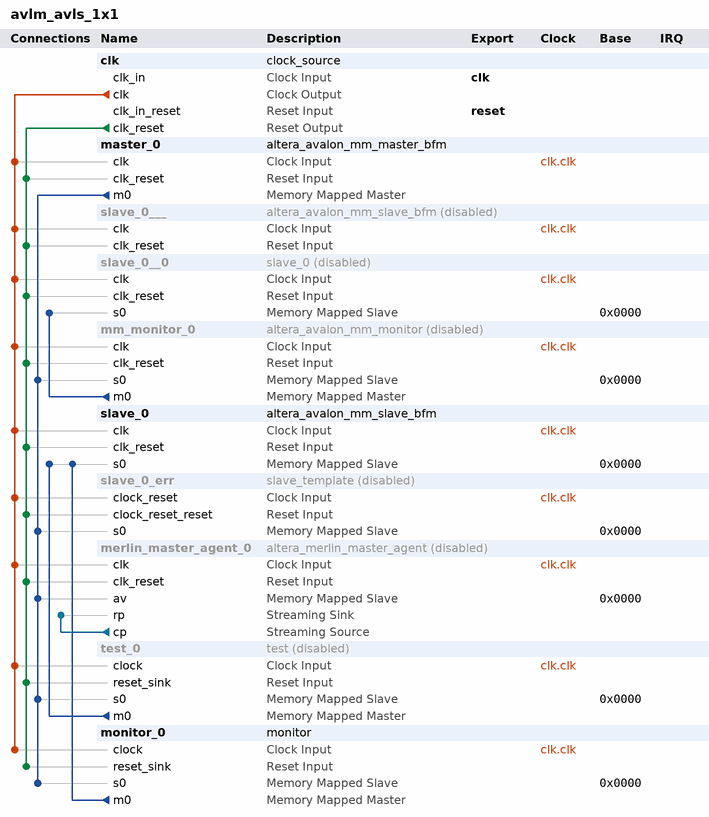
[diagram p0: system contents]
# Platform Designer (Qsys) system avlm_avls_1x1, Cyclone V 5CSEBA6U23I7
# Parameters at their usual value, and those the tool derives, are not listed.
package require -exact qsys 21.1
create_system avlm_avls_1x1
set_project_property DEVICE_FAMILY {Cyclone V}
set_project_property DEVICE 5CSEBA6U23I7

add_instance clk clock_source 21.1
set_instance_parameter_value clk clockFrequency 50000000
set_instance_parameter_value clk resetSynchronousEdges DEASSERT

add_instance master_0 altera_avalon_mm_master_bfm 21.1
set_instance_parameter_value master_0 ADDRESS_UNITS SYMBOLS
set_instance_parameter_value master_0 AV_ADDRESS_W 32
set_instance_parameter_value master_0 AV_ALWAYS_BURST_MAX_BURST 0
set_instance_parameter_value master_0 AV_BURSTCOUNT_W 4
set_instance_parameter_value master_0 AV_BURST_BNDR_ONLY 0
set_instance_parameter_value master_0 AV_BURST_LINEWRAP 0
set_instance_parameter_value master_0 AV_CONSTANT_BURST_BEHAVIOR 1
set_instance_parameter_value master_0 AV_FIX_READ_LATENCY 0
set_instance_parameter_value master_0 AV_MAX_PENDING_READS 8
set_instance_parameter_value master_0 AV_MAX_PENDING_WRITES 0
set_instance_parameter_value master_0 AV_NUMSYMBOLS 4
set_instance_parameter_value master_0 AV_READRESPONSE_W 8
set_instance_parameter_value master_0 AV_READ_WAIT_TIME 1
set_instance_parameter_value master_0 AV_WRITERESPONSE_W 8
set_instance_parameter_value master_0 USE_BURSTCOUNT 1
set_instance_parameter_value master_0 USE_BYTE_ENABLE 1
set_instance_parameter_value master_0 USE_READ 1
set_instance_parameter_value master_0 USE_READ_DATA 1
set_instance_parameter_value master_0 USE_READ_DATA_VALID 1
set_instance_parameter_value master_0 USE_WAIT_REQUEST 1
set_instance_parameter_value master_0 VHDL_ID 0

add_instance slave_0___ altera_avalon_mm_slave_bfm 21.1
set_instance_property slave_0___ ENABLED false
set_instance_parameter_value slave_0___ ADDRESS_UNITS SYMBOLS
set_instance_parameter_value slave_0___ ASSERT_HIGH_ARBITERLOCK 1
set_instance_parameter_value slave_0___ ASSERT_HIGH_BYTEENABLE 1
set_instance_parameter_value slave_0___ ASSERT_HIGH_LOCK 1
set_instance_parameter_value slave_0___ ASSERT_HIGH_READ 1
set_instance_parameter_value slave_0___ ASSERT_HIGH_READDATAVALID 1
set_instance_parameter_value slave_0___ ASSERT_HIGH_RESET 1
set_instance_parameter_value slave_0___ ASSERT_HIGH_WAITREQUEST 1
set_instance_parameter_value slave_0___ ASSERT_HIGH_WRITE 1
set_instance_parameter_value slave_0___ AV_ADDRESS_W 12
set_instance_parameter_value slave_0___ AV_BURSTCOUNT_W 4
set_instance_parameter_value slave_0___ AV_BURST_BNDR_ONLY 0
set_instance_parameter_value slave_0___ AV_BURST_LINEWRAP 0
set_instance_parameter_value slave_0___ AV_FIX_READ_LATENCY 0
set_instance_parameter_value slave_0___ AV_MAX_PENDING_READS 8
set_instance_parameter_value slave_0___ AV_MAX_PENDING_WRITES 0
set_instance_parameter_value slave_0___ AV_NUMSYMBOLS 4
set_instance_parameter_value slave_0___ AV_READRESPONSE_W 8
set_instance_parameter_value slave_0___ AV_READ_WAIT_TIME 1
set_instance_parameter_value slave_0___ AV_REGISTERINCOMINGSIGNALS 0
set_instance_parameter_value slave_0___ AV_SYMBOL_W 8
set_instance_parameter_value slave_0___ AV_WRITERESPONSE_W 8
set_instance_parameter_value slave_0___ AV_WRITE_WAIT_TIME 0
set_instance_parameter_value slave_0___ REGISTER_WAITREQUEST 0
set_instance_parameter_value slave_0___ USE_ADDRESS 1
set_instance_parameter_value slave_0___ USE_ARBITERLOCK 0
set_instance_parameter_value slave_0___ USE_BEGIN_BURST_TRANSFER 0
set_instance_parameter_value slave_0___ USE_BEGIN_TRANSFER 0
set_instance_parameter_value slave_0___ USE_BURSTCOUNT 1
set_instance_parameter_value slave_0___ USE_BYTE_ENABLE 1
set_instance_parameter_value slave_0___ USE_CLKEN 0
set_instance_parameter_value slave_0___ USE_DEBUGACCESS 0
set_instance_parameter_value slave_0___ USE_LOCK 0
set_instance_parameter_value slave_0___ USE_READ 1
set_instance_parameter_value slave_0___ USE_READRESPONSE 0
set_instance_parameter_value slave_0___ USE_READ_DATA 1
set_instance_parameter_value slave_0___ USE_READ_DATA_VALID 1
set_instance_parameter_value slave_0___ USE_TRANSACTIONID 0
set_instance_parameter_value slave_0___ USE_WAIT_REQUEST 1
set_instance_parameter_value slave_0___ USE_WRITE 1
set_instance_parameter_value slave_0___ USE_WRITERESPONSE 0
set_instance_parameter_value slave_0___ USE_WRITE_DATA 1
set_instance_parameter_value slave_0___ VHDL_ID 0

add_instance slave_0__0 slave_0 1.0
set_instance_property slave_0__0 ENABLED false

add_instance mm_monitor_0 altera_avalon_mm_monitor 21.1
set_instance_property mm_monitor_0 ENABLED false
set_instance_parameter_value mm_monitor_0 AV_ADDRESS_W 32
set_instance_parameter_value mm_monitor_0 AV_ALWAYS_BURST_MAX_BURST 0
set_instance_parameter_value mm_monitor_0 AV_BURSTCOUNT_W 3
set_instance_parameter_value mm_monitor_0 AV_BURST_BNDR_ONLY 0
set_instance_parameter_value mm_monitor_0 AV_BURST_LINEWRAP 0
set_instance_parameter_value mm_monitor_0 AV_CONSTANT_BURST_BEHAVIOR 1
set_instance_parameter_value mm_monitor_0 AV_FIX_READ_LATENCY 0
set_instance_parameter_value mm_monitor_0 AV_MAX_CONTINUOUS_READ 5
set_instance_parameter_value mm_monitor_0 AV_MAX_CONTINUOUS_READDATAVALID 5
set_instance_parameter_value mm_monitor_0 AV_MAX_CONTINUOUS_WAITREQUEST 5
set_instance_parameter_value mm_monitor_0 AV_MAX_CONTINUOUS_WRITE 5
set_instance_parameter_value mm_monitor_0 AV_MAX_PENDING_READS 1
set_instance_parameter_value mm_monitor_0 AV_MAX_PENDING_WRITES 0
set_instance_parameter_value mm_monitor_0 AV_MAX_READ_LATENCY 100
set_instance_parameter_value mm_monitor_0 AV_MAX_WAITREQUESTED_READ 100
set_instance_parameter_value mm_monitor_0 AV_MAX_WAITREQUESTED_WRITE 100
set_instance_parameter_value mm_monitor_0 AV_NUMSYMBOLS 4
set_instance_parameter_value mm_monitor_0 AV_READRESPONSE_W 8
set_instance_parameter_value mm_monitor_0 AV_READ_TIMEOUT 100
set_instance_parameter_value mm_monitor_0 AV_READ_WAIT_TIME 1
set_instance_parameter_value mm_monitor_0 AV_REGISTERINCOMINGSIGNALS 0
set_instance_parameter_value mm_monitor_0 AV_SYMBOL_W 8
set_instance_parameter_value mm_monitor_0 AV_WAITREQUEST_TIMEOUT 1024
set_instance_parameter_value mm_monitor_0 AV_WRITERESPONSE_W 8
set_instance_parameter_value mm_monitor_0 AV_WRITE_TIMEOUT 100
set_instance_parameter_value mm_monitor_0 AV_WRITE_WAIT_TIME 0
set_instance_parameter_value mm_monitor_0 MASTER_ADDRESS_TYPE SYMBOLS
set_instance_parameter_value mm_monitor_0 REGISTER_WAITREQUEST 0
set_instance_parameter_value mm_monitor_0 SLAVE_ADDRESS_TYPE WORDS
set_instance_parameter_value mm_monitor_0 USE_ADDRESS 1
set_instance_parameter_value mm_monitor_0 USE_ARBITERLOCK 0
set_instance_parameter_value mm_monitor_0 USE_BEGIN_BURST_TRANSFER 0
set_instance_parameter_value mm_monitor_0 USE_BEGIN_TRANSFER 0
set_instance_parameter_value mm_monitor_0 USE_BURSTCOUNT 0
set_instance_parameter_value mm_monitor_0 USE_BYTE_ENABLE 1
set_instance_parameter_value mm_monitor_0 USE_CLKEN 0
set_instance_parameter_value mm_monitor_0 USE_DEBUGACCESS 0
set_instance_parameter_value mm_monitor_0 USE_LOCK 0
set_instance_parameter_value mm_monitor_0 USE_READ 1
set_instance_parameter_value mm_monitor_0 USE_READRESPONSE 0
set_instance_parameter_value mm_monitor_0 USE_READ_DATA 1
set_instance_parameter_value mm_monitor_0 USE_READ_DATA_VALID 1
set_instance_parameter_value mm_monitor_0 USE_TRANSACTIONID 0
set_instance_parameter_value mm_monitor_0 USE_WAIT_REQUEST 1
set_instance_parameter_value mm_monitor_0 USE_WRITE 1
set_instance_parameter_value mm_monitor_0 USE_WRITERESPONSE 0
set_instance_parameter_value mm_monitor_0 USE_WRITE_DATA 1
set_instance_parameter_value mm_monitor_0 VHDL_ID 0

add_instance slave_0 altera_avalon_mm_slave_bfm 21.1
set_instance_parameter_value slave_0 ADDRESS_UNITS SYMBOLS
set_instance_parameter_value slave_0 ASSERT_HIGH_ARBITERLOCK 1
set_instance_parameter_value slave_0 ASSERT_HIGH_BYTEENABLE 1
set_instance_parameter_value slave_0 ASSERT_HIGH_LOCK 1
set_instance_parameter_value slave_0 ASSERT_HIGH_READ 1
set_instance_parameter_value slave_0 ASSERT_HIGH_READDATAVALID 1
set_instance_parameter_value slave_0 ASSERT_HIGH_RESET 1
set_instance_parameter_value slave_0 ASSERT_HIGH_WAITREQUEST 1
set_instance_parameter_value slave_0 ASSERT_HIGH_WRITE 1
set_instance_parameter_value slave_0 AV_ADDRESS_W 12
set_instance_parameter_value slave_0 AV_BURSTCOUNT_W 4
set_instance_parameter_value slave_0 AV_BURST_BNDR_ONLY 0
set_instance_parameter_value slave_0 AV_BURST_LINEWRAP 0
set_instance_parameter_value slave_0 AV_FIX_READ_LATENCY 0
set_instance_parameter_value slave_0 AV_MAX_PENDING_READS 1
set_instance_parameter_value slave_0 AV_MAX_PENDING_WRITES 0
set_instance_parameter_value slave_0 AV_NUMSYMBOLS 4
set_instance_parameter_value slave_0 AV_READRESPONSE_W 8
set_instance_parameter_value slave_0 AV_READ_WAIT_TIME 1
set_instance_parameter_value slave_0 AV_REGISTERINCOMINGSIGNALS 0
set_instance_parameter_value slave_0 AV_SYMBOL_W 8
set_instance_parameter_value slave_0 AV_WRITERESPONSE_W 8
set_instance_parameter_value slave_0 AV_WRITE_WAIT_TIME 0
set_instance_parameter_value slave_0 REGISTER_WAITREQUEST 0
set_instance_parameter_value slave_0 USE_ADDRESS 1
set_instance_parameter_value slave_0 USE_ARBITERLOCK 0
set_instance_parameter_value slave_0 USE_BEGIN_BURST_TRANSFER 0
set_instance_parameter_value slave_0 USE_BEGIN_TRANSFER 0
set_instance_parameter_value slave_0 USE_BURSTCOUNT 1
set_instance_parameter_value slave_0 USE_BYTE_ENABLE 1
set_instance_parameter_value slave_0 USE_CLKEN 0
set_instance_parameter_value slave_0 USE_DEBUGACCESS 0
set_instance_parameter_value slave_0 USE_LOCK 0
set_instance_parameter_value slave_0 USE_READ 1
set_instance_parameter_value slave_0 USE_READRESPONSE 0
set_instance_parameter_value slave_0 USE_READ_DATA 1
set_instance_parameter_value slave_0 USE_READ_DATA_VALID 1
set_instance_parameter_value slave_0 USE_TRANSACTIONID 0
set_instance_parameter_value slave_0 USE_WAIT_REQUEST 1
set_instance_parameter_value slave_0 USE_WRITE 1
set_instance_parameter_value slave_0 USE_WRITERESPONSE 0
set_instance_parameter_value slave_0 USE_WRITE_DATA 1
set_instance_parameter_value slave_0 VHDL_ID 0

add_instance slave_0_err slave_template 2.0
set_instance_property slave_0_err ENABLED false
set_instance_parameter_value slave_0_err DATA_WIDTH 8
set_instance_parameter_value slave_0_err ENABLE_SYNC_SIGNALS 1
set_instance_parameter_value slave_0_err IRQ_EN 0
set_instance_parameter_value slave_0_err MODE_0 2
set_instance_parameter_value slave_0_err MODE_1 4
set_instance_parameter_value slave_0_err MODE_10 4
set_instance_parameter_value slave_0_err MODE_11 4
set_instance_parameter_value slave_0_err MODE_12 4
set_instance_parameter_value slave_0_err MODE_13 4
set_instance_parameter_value slave_0_err MODE_14 4
set_instance_parameter_value slave_0_err MODE_15 4
set_instance_parameter_value slave_0_err MODE_2 4
set_instance_parameter_value slave_0_err MODE_3 4
set_instance_parameter_value slave_0_err MODE_4 4
set_instance_parameter_value slave_0_err MODE_5 4
set_instance_parameter_value slave_0_err MODE_6 4
set_instance_parameter_value slave_0_err MODE_7 4
set_instance_parameter_value slave_0_err MODE_8 4
set_instance_parameter_value slave_0_err MODE_9 4

add_instance merlin_master_agent_0 altera_merlin_master_agent 21.1
set_instance_property merlin_master_agent_0 ENABLED false
set_instance_parameter_value merlin_master_agent_0 AV_BURSTBOUNDARIES 0
set_instance_parameter_value merlin_master_agent_0 AV_BURSTCOUNT_W 3
set_instance_parameter_value merlin_master_agent_0 AV_LINEWRAPBURSTS 0
set_instance_parameter_value merlin_master_agent_0 BURSTWRAP_VALUE 4
set_instance_parameter_value merlin_master_agent_0 CACHE_VALUE 0
set_instance_parameter_value merlin_master_agent_0 ID 1
set_instance_parameter_value merlin_master_agent_0 PKT_ADDR_H 73
set_instance_parameter_value merlin_master_agent_0 PKT_ADDR_L 42
set_instance_parameter_value merlin_master_agent_0 PKT_ADDR_SIDEBAND_H 99
set_instance_parameter_value merlin_master_agent_0 PKT_ADDR_SIDEBAND_L 95
set_instance_parameter_value merlin_master_agent_0 PKT_BEGIN_BURST 81
set_instance_parameter_value merlin_master_agent_0 PKT_BURSTWRAP_H 79
set_instance_parameter_value merlin_master_agent_0 PKT_BURSTWRAP_L 77
set_instance_parameter_value merlin_master_agent_0 PKT_BURST_SIZE_H 86
set_instance_parameter_value merlin_master_agent_0 PKT_BURST_SIZE_L 84
set_instance_parameter_value merlin_master_agent_0 PKT_BURST_TYPE_H 94
set_instance_parameter_value merlin_master_agent_0 PKT_BURST_TYPE_L 93
set_instance_parameter_value merlin_master_agent_0 PKT_BYTEEN_H 5
set_instance_parameter_value merlin_master_agent_0 PKT_BYTEEN_L 2
set_instance_parameter_value merlin_master_agent_0 PKT_BYTE_CNT_H 76
set_instance_parameter_value merlin_master_agent_0 PKT_BYTE_CNT_L 74
set_instance_parameter_value merlin_master_agent_0 PKT_CACHE_H 92
set_instance_parameter_value merlin_master_agent_0 PKT_CACHE_L 89
set_instance_parameter_value merlin_master_agent_0 PKT_DATA_H 37
set_instance_parameter_value merlin_master_agent_0 PKT_DATA_L 6
set_instance_parameter_value merlin_master_agent_0 PKT_DATA_SIDEBAND_H 107
set_instance_parameter_value merlin_master_agent_0 PKT_DATA_SIDEBAND_L 100
set_instance_parameter_value merlin_master_agent_0 PKT_DEST_ID_H 0
set_instance_parameter_value merlin_master_agent_0 PKT_DEST_ID_L 0
set_instance_parameter_value merlin_master_agent_0 PKT_ORI_BURST_SIZE_H 116
set_instance_parameter_value merlin_master_agent_0 PKT_ORI_BURST_SIZE_L 114
set_instance_parameter_value merlin_master_agent_0 PKT_PROTECTION_H 80
set_instance_parameter_value merlin_master_agent_0 PKT_PROTECTION_L 80
set_instance_parameter_value merlin_master_agent_0 PKT_QOS_H 111
set_instance_parameter_value merlin_master_agent_0 PKT_QOS_L 108
set_instance_parameter_value merlin_master_agent_0 PKT_RESPONSE_STATUS_H 113
set_instance_parameter_value merlin_master_agent_0 PKT_RESPONSE_STATUS_L 112
set_instance_parameter_value merlin_master_agent_0 PKT_SRC_ID_H 1
set_instance_parameter_value merlin_master_agent_0 PKT_SRC_ID_L 1
set_instance_parameter_value merlin_master_agent_0 PKT_THREAD_ID_H 88
set_instance_parameter_value merlin_master_agent_0 PKT_THREAD_ID_L 87
set_instance_parameter_value merlin_master_agent_0 PKT_TRANS_COMPRESSED_READ 41
set_instance_parameter_value merlin_master_agent_0 PKT_TRANS_EXCLUSIVE 83
set_instance_parameter_value merlin_master_agent_0 PKT_TRANS_LOCK 82
set_instance_parameter_value merlin_master_agent_0 PKT_TRANS_POSTED 40
set_instance_parameter_value merlin_master_agent_0 PKT_TRANS_READ 38
set_instance_parameter_value merlin_master_agent_0 PKT_TRANS_WRITE 39
set_instance_parameter_value merlin_master_agent_0 SECURE_ACCESS_BIT 1
set_instance_parameter_value merlin_master_agent_0 ST_CHANNEL_W 1
set_instance_parameter_value merlin_master_agent_0 ST_DATA_W 115
set_instance_parameter_value merlin_master_agent_0 SUPPRESS_0_BYTEEN_RSP 1
set_instance_parameter_value merlin_master_agent_0 USE_READRESPONSE 0
set_instance_parameter_value merlin_master_agent_0 USE_WRITERESPONSE 0

add_instance test_0 test 1.0
set_instance_property test_0 ENABLED false
set_instance_parameter_value test_0 ADDRESS_WIDTH 12
set_instance_parameter_value test_0 BURST_WIDTH 4
set_instance_parameter_value test_0 BYTE_WIDTH 4
set_instance_parameter_value test_0 DATA_WIDTH 32

add_instance monitor_0 monitor 1.0
set_instance_parameter_value monitor_0 ADDRESS_WIDTH 12
set_instance_parameter_value monitor_0 BURST_WIDTH 4
set_instance_parameter_value monitor_0 BYTE_WIDTH 4
set_instance_parameter_value monitor_0 DATA_WIDTH 32

# connections
add_connection clk.clk master_0.clk clock
add_connection clk.clk merlin_master_agent_0.clk clock
add_connection clk.clk mm_monitor_0.clk clock
add_connection clk.clk monitor_0.clock clock
add_connection clk.clk slave_0.clk clock
add_connection clk.clk slave_0__0.clk clock
add_connection clk.clk slave_0___.clk clock
add_connection clk.clk slave_0_err.clock_reset clock
add_connection clk.clk test_0.clock clock
add_connection clk.clk_reset master_0.clk_reset reset
add_connection clk.clk_reset merlin_master_agent_0.clk_reset reset
add_connection clk.clk_reset mm_monitor_0.clk_reset reset
add_connection clk.clk_reset monitor_0.reset_sink reset
add_connection clk.clk_reset slave_0.clk_reset reset
add_connection clk.clk_reset slave_0__0.clk_reset reset
add_connection clk.clk_reset slave_0___.clk_reset reset
add_connection clk.clk_reset slave_0_err.clock_reset_reset reset
add_connection clk.clk_reset test_0.reset_sink reset
add_connection master_0.m0 merlin_master_agent_0.av avalon
set_connection_parameter_value master_0.m0/merlin_master_agent_0.av baseAddress 0x0000
add_connection master_0.m0 mm_monitor_0.s0 avalon
set_connection_parameter_value master_0.m0/mm_monitor_0.s0 baseAddress 0x0000
add_connection master_0.m0 monitor_0.s0 avalon
set_connection_parameter_value master_0.m0/monitor_0.s0 baseAddress 0x0000
add_connection master_0.m0 slave_0_err.s0 avalon
set_connection_parameter_value master_0.m0/slave_0_err.s0 baseAddress 0x0000
add_connection master_0.m0 test_0.s0 avalon
set_connection_parameter_value master_0.m0/test_0.s0 baseAddress 0x0000
add_connection mm_monitor_0.m0 slave_0__0.s0 avalon
set_connection_parameter_value mm_monitor_0.m0/slave_0__0.s0 baseAddress 0x0000
add_connection monitor_0.m0 slave_0.s0 avalon
set_connection_parameter_value monitor_0.m0/slave_0.s0 baseAddress 0x0000
add_connection test_0.m0 slave_0.s0 avalon
set_connection_parameter_value test_0.m0/slave_0.s0 baseAddress 0x0000
add_connection merlin_master_agent_0.cp merlin_master_agent_0.rp avalon_streaming

# exported interfaces
add_interface clk clock sink
set_interface_property clk EXPORT_OF clk.clk_in
add_interface reset reset sink
set_interface_property reset EXPORT_OF clk.clk_in_reset

set_interconnect_requirement {$system} qsys_mm.clockCrossingAdapter HANDSHAKE
set_interconnect_requirement {$system} qsys_mm.insertDefaultSlave FALSE
set_interconnect_requirement {$system} qsys_mm.maxAdditionalLatency 1

save_system avlm_avls_1x1.qsys
